# EAGLE design as3320-BandPass-Dev2 (EAGLE 9.6.2)

## Sheet 1 of 5: CEM
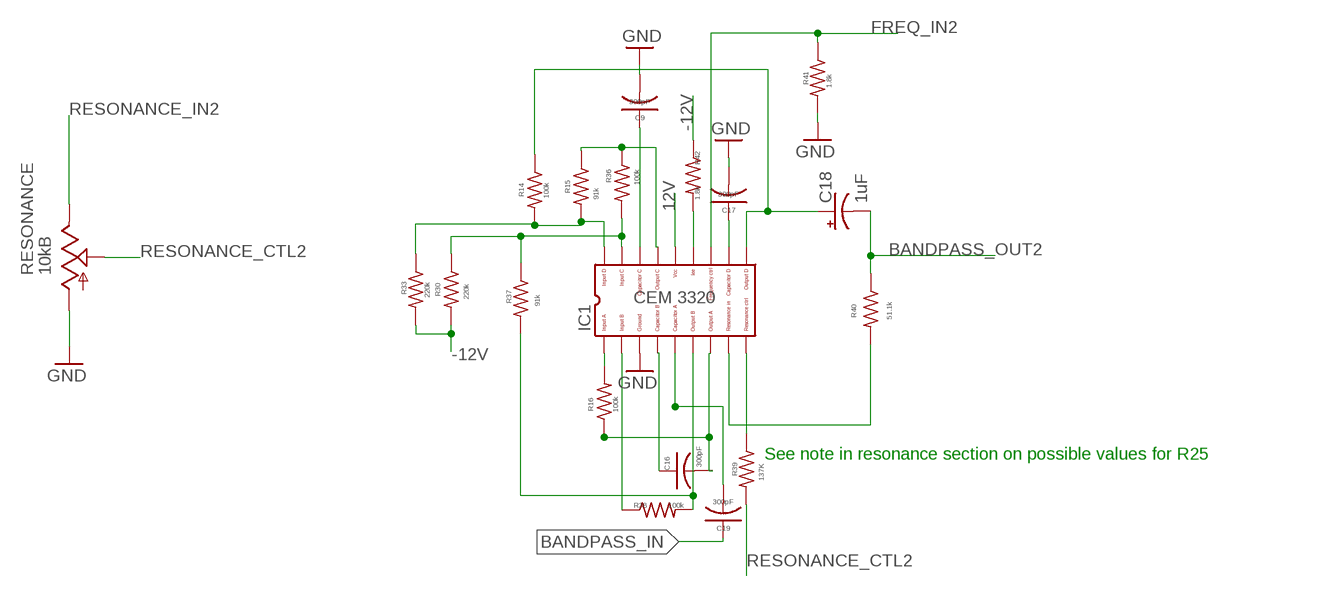
[diagram p0: schematic, sheet 1]

### Parts
C9  300pF  C-USC0805K  [C0805K]
C16  300pF  C-USC0805K  [C0805K]
C17  300pF  C-USC0805K  [C0805K]
C18  1uF  CPOL-USB  [PANASONIC_B]
C19  300pF  C-USC0805K  [C0805K]
IC1  CEM3320  [DIL18]
R14  100k  GMSN_R-US_M0805  [GMSN_M0805]
R15  91k  GMSN_R-US_M0805  [GMSN_M0805]
R16  100k  GMSN_R-US_M0805  [GMSN_M0805]
R30  220k  GMSN_R-US_M0805  [GMSN_M0805]
R33  220k  GMSN_R-US_M0805  [GMSN_M0805]
R36  100k  GMSN_R-US_M0805  [GMSN_M0805]
R37  91k  GMSN_R-US_M0805  [GMSN_M0805]
R38  100k  GMSN_R-US_M0805  [GMSN_M0805]
R39  137K  GMSN_R-US_M0805  [GMSN_M0805]
R40  51.1k  GMSN_R-US_M0805  [GMSN_M0805]
R41  1.8k  GMSN_R-US_M0805  [GMSN_M0805]
R42  1.8k  GMSN_R-US_M0805  [GMSN_M0805]
RESONANCE  10kB  POT_USVERTICAL  [ALPS_POT_VERTICAL]

### Nets
12V [power]: IC1.14 ; also sheet 2,3
-12V [power]: R30.2 R33.2 R42.1 ; also sheet 2,3
BANDPASS_IN: C19.1 ; also sheet 3
BANDPASS_OUT2: C18.- R40.1 ; also sheet 5
FREQ_IN2: IC1.12 R41.1 ; also sheet 3
GND [power]: C9.2 C17.2 IC1.3 R41.2 RESONANCE.P$3(A) ; also sheet 2,3,4,5
N$18 [nearfilter]: C17.1 IC1.11
N$21: IC1.9 R39.1
N$28 [nearfilter]: IC1.8 R40.2
N$29 [nearfilter]: IC1.13 R42.2
N$30: C9.1 IC1.16
N$31 [nearfilter]: C18.+ IC1.10 R14.1
N$32: C19.2 IC1.5
N$33: C16.2 IC1.7 R16.1
N$34: C16.1 IC1.4
N$35: IC1.2 R38.1
N$36: IC1.6 R37.2 R38.2
N$37: IC1.1 R16.2
N$38: IC1.17 R30.1 R36.2 R37.1
N$41: IC1.15 R15.1 R36.1
N$42: IC1.18 R14.2 R15.2 R33.1
RESONANCE_CTL2: R39.2 RESONANCE.P$2(S)
RESONANCE_IN2: RESONANCE.P$1(E) ; also sheet 3

### Notes on the sheet
- See note in resonance section on possible values for R25

## Sheet 2 of 5: Power
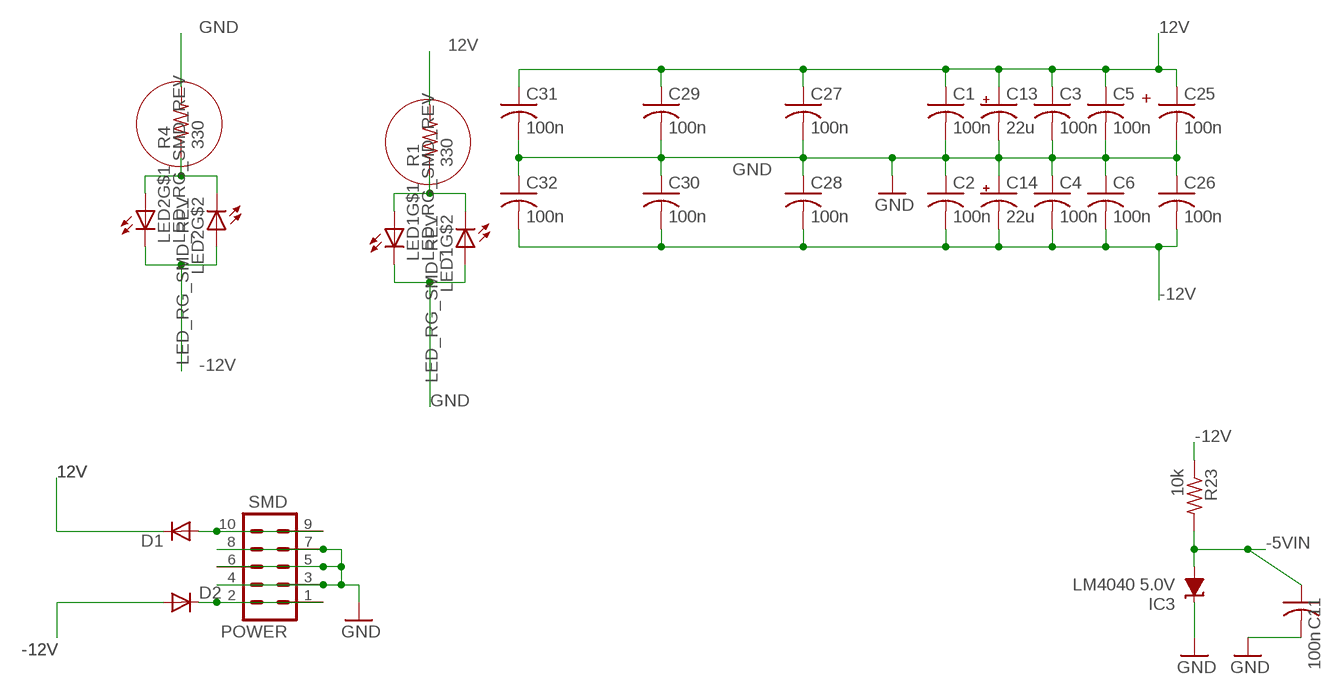
[diagram p1: schematic, sheet 2]

### Parts
C1  100n  C-USC0805K  [C0805K]
C2  100n  C-USC0805K  [C0805K]
C3  100n  C-USC0805K  [C0805K]
C4  100n  C-USC0805K  [C0805K]
C5  100n  C-USC0805K  [C0805K]
C6  100n  C-USC0805K  [C0805K]
C11  100n  GMSN_C-USC0805K  [GMSN_C0805K]
C13  22u  CPOL-USB  [PANASONIC_B]
C14  22u  CPOL-USB  [PANASONIC_B]
C25  100n  C-USC0805K  [C0805K]
C26  100n  C-USC0805K  [C0805K]
C27  100n  C-USC0805K  [C0805K]
C28  100n  C-USC0805K  [C0805K]
C29  100n  C-USC0805K  [C0805K]
C30  100n  C-USC0805K  [C0805K]
C31  100n  C-USC0805K  [C0805K]
C32  100n  C-USC0805K  [C0805K]
D1  1N5819HW  DIODE-SOD123  [SOD123]
D2  1N5819HW  DIODE-SOD123  [SOD123]
IC3  LM4040 5.0V  LM4041C12DBZ  [DBZ_R-PDSO-G3]
LED1  LED_RG_SMD_REV  [LSG_T77K]
LED2  LED_RG_SMD_REV  [LSG_T77K]
POWER  SMD  CONN_05X2SHD_SMD  [2X5-SHROUDED_SMD]
R1  330  GMSN_R-US_M0805  [GMSN_M0805]
R4  330  GMSN_R-US_M0805  [GMSN_M0805]
R23  10k  GMSN_R-US_M0805  [GMSN_M0805]

### Nets
12V [power]: C1.1 C3.1 C5.1 C13.+ C25.1 C27.1 C29.1 C31.1 D1.C R1.2 ; also sheet 1,3
-5VIN [power]: C11.1 IC3.2(A) R23.2 ; also sheet 4
-12V [power]: C2.2 C4.2 C6.2 C14.- C26.2 C28.2 C30.2 C32.2 D2.A LED2.1(C) LED2.4(A) R23.1 ; also sheet 1,3
-12V-P: D2.C POWER.1 POWER.2
GND [power]: C1.2 C2.1 C3.2 C4.1 C5.2 C6.1 C11.2 C13.- C14.+ C25.2 C26.1 C27.2 C28.1 C29.2 C30.1 C31.2 C32.1 IC3.1(C) LED1.1(C) LED1.4(A) POWER.3 POWER.4 POWER.5 POWER.6 POWER.7 POWER.8 R4.2 ; also sheet 1,3,4,5
N$6: D1.A POWER.9 POWER.10
N$74: LED2.2(A) LED2.3(C) R4.1
N$75: LED1.2(A) LED1.3(C) R1.1

### Notes on the sheet
- +

## Sheet 3 of 5: Input
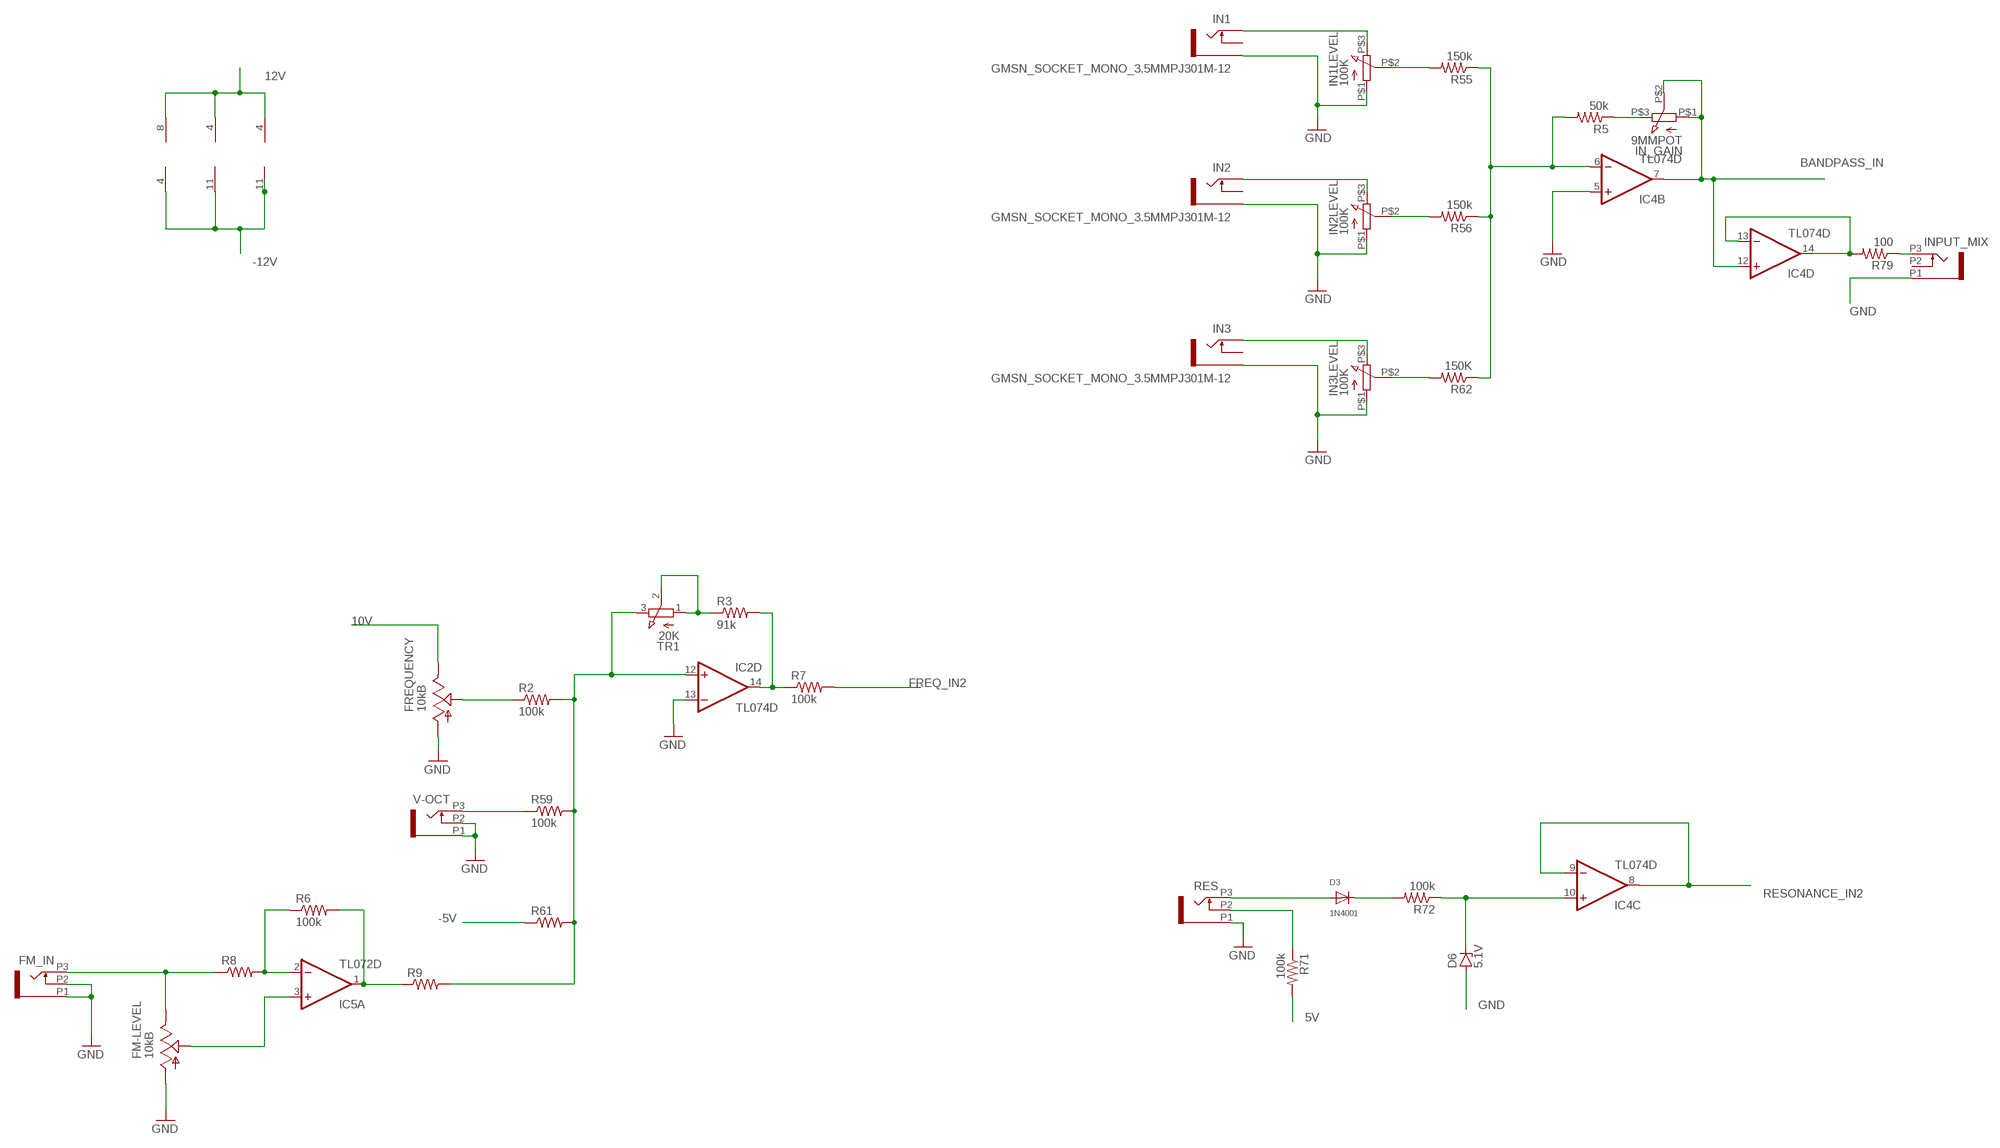
[diagram p2: schematic, sheet 3]

### Parts
D3  1N4001  DIODESMA  [SMADIODE]
D6  5.1V  ZENER-DIODESOT23  [SOT23]
FM-LEVEL  10kB  POT_USVERTICAL  [ALPS_POT_VERTICAL]
FM_IN  PJ301_THONKICONN6  [WQP_PJ_301M6]
FREQUENCY  10kB  POT_USVERTICAL  [ALPS_POT_VERTICAL]
IC2  TL074D  [SO14]
IC4  TL074D  [SO14]
IC5  TL072D  [SO08]
IN1  GMSN_SOCKET_MONO_3.5MMPJ301M-12  [GMSN_PJ301M-12]
IN1LEVEL  100K  9MMPOT  [POT]
IN2  GMSN_SOCKET_MONO_3.5MMPJ301M-12  [GMSN_PJ301M-12]
IN2LEVEL  100K  9MMPOT  [POT]
IN3  GMSN_SOCKET_MONO_3.5MMPJ301M-12  [GMSN_PJ301M-12]
IN3LEVEL  100K  9MMPOT  [POT]
IN_GAIN  9MMPOT  [POT]
INPUT_MIX  PJ301_THONKICONN6  [WQP_PJ_301M6]
R2  100k  GMSN_R-US_M0805  [GMSN_M0805]
R3  91k  GMSN_R-US_M0805  [GMSN_M0805]
R5  50k  GMSN_R-US_M0805  [GMSN_M0805]
R6  100k  GMSN_R-US_M0805  [GMSN_M0805]
R7  100k  GMSN_R-US_M0805  [GMSN_M0805]
R8  62k  GMSN_R-US_M0805  [GMSN_M0805]
R9  62k  GMSN_R-US_M0805  [GMSN_M0805]
R55  150k  R-US_R0805  [R0805]
R56  150k  R-US_R0805  [R0805]
R59  100k  GMSN_R-US_M0805  [GMSN_M0805]
R61  62k  GMSN_R-US_M0805  [GMSN_M0805]
R62  150K  R-US_R0805  [R0805]
R71  100k  R-US_R0805  [R0805]
R72  100k  GMSN_R-US_M0805  [GMSN_M0805]
R79  100  GMSN_R-US_M0805  [GMSN_M0805]
RES  PJ301_THONKICONN6  [WQP_PJ_301M6]
TR1  20K  TRIMMER_TH3  [TRIMMER_TH3]
V-OCT  PJ301_THONKICONN6  [WQP_PJ_301M6]

### Nets
5V [power]: R71.2 ; also sheet 4
10V [power]: FREQUENCY.P$1(E) ; also sheet 4
12V [power]: IC2.4(P:V+) IC4.4(P:V+) IC5.8(P:V+) ; also sheet 1,2
-5V [power]: R61.1 ; also sheet 4
-12V [power]: IC2.11(P:V-) IC4.11(P:V-) IC5.4(P:V-) ; also sheet 1,2
BANDPASS_IN: IC4.7(B:OUT) IC4.12(D:+IN) IN_GAIN.P$1 IN_GAIN.P$2 ; also sheet 1
FREQ_IN2: R7.2 ; also sheet 1
GND [power]: D6.1(A) FM-LEVEL.P$3(A) FM_IN.P1 FM_IN.P2 FREQUENCY.P$3(A) IC2.13(D:-IN) IC4.5(B:+IN) IN1.GND(SLEEVE) IN1LEVEL.P$1 IN2.GND(SLEEVE) IN2LEVEL.P$1 IN3.GND(SLEEVE) IN3LEVEL.P$1 INPUT_MIX.P1 RES.P1 V-OCT.P1 V-OCT.P2 ; also sheet 1,2,4,5
N$2: IC5.2(A:-IN) R6.1 R8.2
N$3: IC2.14(D:OUT) R3.2 R7.1
N$4: IC5.1(A:OUT) R6.2 R9.1
N$5: FREQUENCY.P$2(S) R2.1
N$7: FM-LEVEL.P$2(S) IC5.3(A:+IN)
N$8: FM-LEVEL.P$1(E) FM_IN.P3 R8.1
N$9: R71.1 RES.P2
N$12: IC2.12(D:+IN) R2.2 R9.2 R59.2 R61.2 TR1.3
N$20: IN_GAIN.P$3 R5.1
N$67: R59.1 V-OCT.P3
N$68: R3.1 TR1.1 TR1.2
N$76: IN1.TIP IN1LEVEL.P$3
N$77: IN2.TIP IN2LEVEL.P$3
N$78: D3.A RES.P3
N$79: IN1LEVEL.P$2 R55.2
N$80: IN2LEVEL.P$2 R56.2
N$82: IN3.TIP IN3LEVEL.P$3
N$83: IN3LEVEL.P$2 R62.2
N$84: IC4.6(B:-IN) R5.2 R55.1 R56.1 R62.1
N$85: D3.C R72.2
N$89: D6.3(C) IC4.10(C:+IN) R72.1
N$102: IC4.13(D:-IN) IC4.14(D:OUT) R79.2
N$103: INPUT_MIX.P3 R79.1
RESONANCE_IN2: IC4.8(C:OUT) IC4.9(C:-IN) ; also sheet 1
Unconnected: IN1.NORM(SWITCH) IN2.NORM(SWITCH) IN3.NORM(SWITCH) INPUT_MIX.P2

## Sheet 4 of 5: Ref
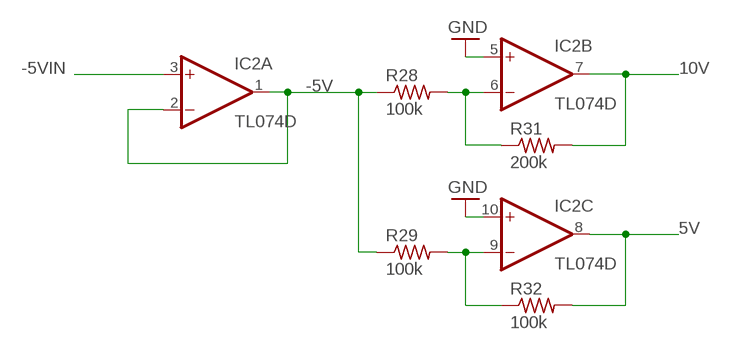
[diagram p3: schematic, sheet 4]

### Parts
R28  100k  GMSN_R-US_M0805  [GMSN_M0805]
R29  100k  GMSN_R-US_M0805  [GMSN_M0805]
R31  200k  GMSN_R-US_M0805  [GMSN_M0805]
R32  100k  GMSN_R-US_M0805  [GMSN_M0805]

### Nets
5V [power]: IC2.8(C:OUT) R32.2 ; also sheet 3
10V [power]: IC2.7(B:OUT) R31.2 ; also sheet 3
-5V [power]: IC2.1(A:OUT) IC2.2(A:-IN) R28.1 R29.1 ; also sheet 3
-5VIN [power]: IC2.3(A:+IN) ; also sheet 2
GND [power]: IC2.5(B:+IN) IC2.10(C:+IN) ; also sheet 1,2,3,5
N$13: IC2.9(C:-IN) R29.2 R32.1
N$15: IC2.6(B:-IN) R28.2 R31.1

## Sheet 5 of 5: Output
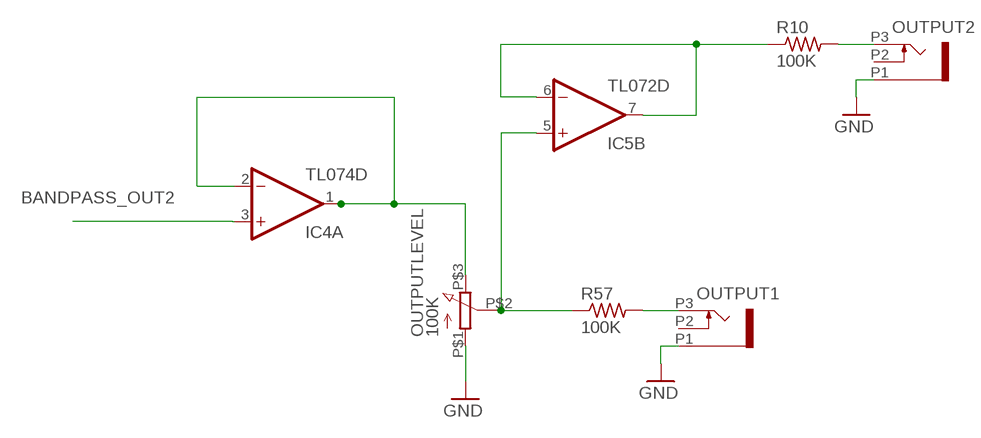
[diagram p4: schematic, sheet 5]

### Parts
OUTPUT1  PJ301_THONKICONN6  [WQP_PJ_301M6]
OUTPUT2  PJ301_THONKICONN6  [WQP_PJ_301M6]
OUTPUTLEVEL  100K  9MMPOT  [POT]
R10  100K  GMSN_R-US_M0805  [GMSN_M0805]
R57  100K  GMSN_R-US_M0805  [GMSN_M0805]

### Nets
BANDPASS_OUT2: IC4.3(A:+IN) ; also sheet 1
GND [power]: OUTPUT1.P1 OUTPUT2.P1 OUTPUTLEVEL.P$1 ; also sheet 1,2,3,4
N$11: IC5.5(B:+IN) OUTPUTLEVEL.P$2 R57.1
N$14: IC5.6(B:-IN) IC5.7(B:OUT) R10.1
N$63: IC4.1(A:OUT) IC4.2(A:-IN) OUTPUTLEVEL.P$3
O1: OUTPUT2.P3 R10.2
O2: OUTPUT1.P3 R57.2
Unconnected: OUTPUT1.P2 OUTPUT2.P2

## Library data of the parts
C1-C6 C9 C16 C17 C19 C25-C32 = rcl:C-US: CAPACITOR, American symbol; SPICEPREFIX: C
C11 = Pure VCF:GMSN_C-US: CAPACITOR, American symbol
C13 C14 = rcl:CPOL-US: POLARIZED CAPACITOR, American symbol
C18 = rcl:CPOL-US: POLARIZED CAPACITOR, American symbol; SPICEPREFIX: C
D1 D2 = diode:DIODE-: DIODE
D3 = GMSN:DIODE: Diode SMADIODE - SMA Surface Mount Package 20V 1A Schottky Diode Digikey: 641-1014-6-ND DO-1N4148 - Through Hole Small Current Diode SOD-123 20V 1 A (.5mV Vf) Schottky Diode - Digikey: MBRX120TPMSCT-ND SOD-323 10V 570mA (.38mV Vf, 3ns) Schottky Diode - Digikey: ZLLS410CT-ND SOD-523 30V 30mA Schottky Diode (RB751S-40TE61) - Digikey: RB751S-40TE61CT-ND SOT23-R/W - SOT23 Package (R = Solder Paste/Reflow Ovens, W = Hand-Soldering) BAT54Film 40V 300mA - Digikey: 497-7162-1-ND
D6 = diode:ZENER-DIODE: Z-Diode; RS-PART: 816-7962
FM-LEVEL FREQUENCY RESONANCE = og-pots:POT_US
FM_IN INPUT_MIX OUTPUT1 OUTPUT2 RES V-OCT = og-pj301_variations:PJ301_THONKICONN
IC1 = CEM:CEM3320: CEM 3330 VCF
IC2 = linear:TL074: OP AMP
IC3 = texas:LM4041: PRECISION MICROPOWER SHUNT VOLTAGE REFERENCE Source: http://focus.ti.com/lit/ds/slcs146e/slcs146e.pdf
IC4 = GMSN:TL074: OP AMP
IC5 = GMSN-R2Project:TL072: OP AMP
IN1-IN3 = Pure VCO:GMSN_SOCKET_MONO_3.5MM: 3.5 mm Jack Socket; SORT: 8
IN1LEVEL IN2LEVEL IN3LEVEL IN_GAIN OUTPUTLEVEL = GMSN:9MMPOT
LED1 = INSTRUO:LED_RG_SMD_REV: http://uk.rs-online.com/web/p/visible-leds/7193196/; RS-PART: 915-4828
LED2 = INSTRUO:LED_RG_SMD_REV: http://uk.rs-online.com/web/p/visible-leds/7193196/
POWER = SparkFun-Connectors:CONN_05X2: Multi connection point. Often used as Generic Header-pin footprint for 0.1 inch spaced/style header connections For AVR SPI programming port, see special device with nice symbol: "AVR_SPI_PROG_5x2.dev" You can populate with any combo of single row headers, but if you'd like an exact match, check these: 2x5 AVR ICSP Male Header <https://www.sparkfun.com/products/778> (PRT-00778) 2x5 Pin Shrouded Header <https://www.sparkfun.com/products/8506> (PRT-08506) On any of the 0.1 inch spaced packages, you can populate with these: Break Away Headers - Straight <https://www.sparkfun.com/products/116> (PRT-00116) Break Away Male Headers - Right Angle <https://www.sparkfun.com/products/553> (PRT-00553) Female Headers <https://www.sparkfun.com/products/115> (PRT-00115) Break Away Headers - Machine Pin <https://www.sparkfun.com/products/117> (PRT-00117) Break Away Female Headers - Swiss Machine Pin <https://www.sparkfun.com/products/743> (PRT-00743) Special note: the shrouded connector mates well with our 5x2 ribbon cables: 2x5 Pin IDC Ribbon Cable <https://www.sparkfun.com/products/8535> (PRT-08535); PROD_ID: CONN-09508; RS-PART: 828-1783
R1-R3 R5-R10 R14-R16 R23 R28-R33 R36-R42 R57 R59 R61 R72 R79 = Pure VCF:GMSN_R-US_: RESISTOR, American symbol
R4 = Pure VCF:GMSN_R-US_: RESISTOR, American symbol; RS-PART: 915-4828
R55 R56 R62 R71 = GMSN:R-US_: RESISTOR, American symbol
TR1 = GMSN:TRIMMER_TH3

## Net classes
0 default: width 0.152 mm
1 power: width 0.406 mm
2 nearfilter: width 0.152 mm

## Board
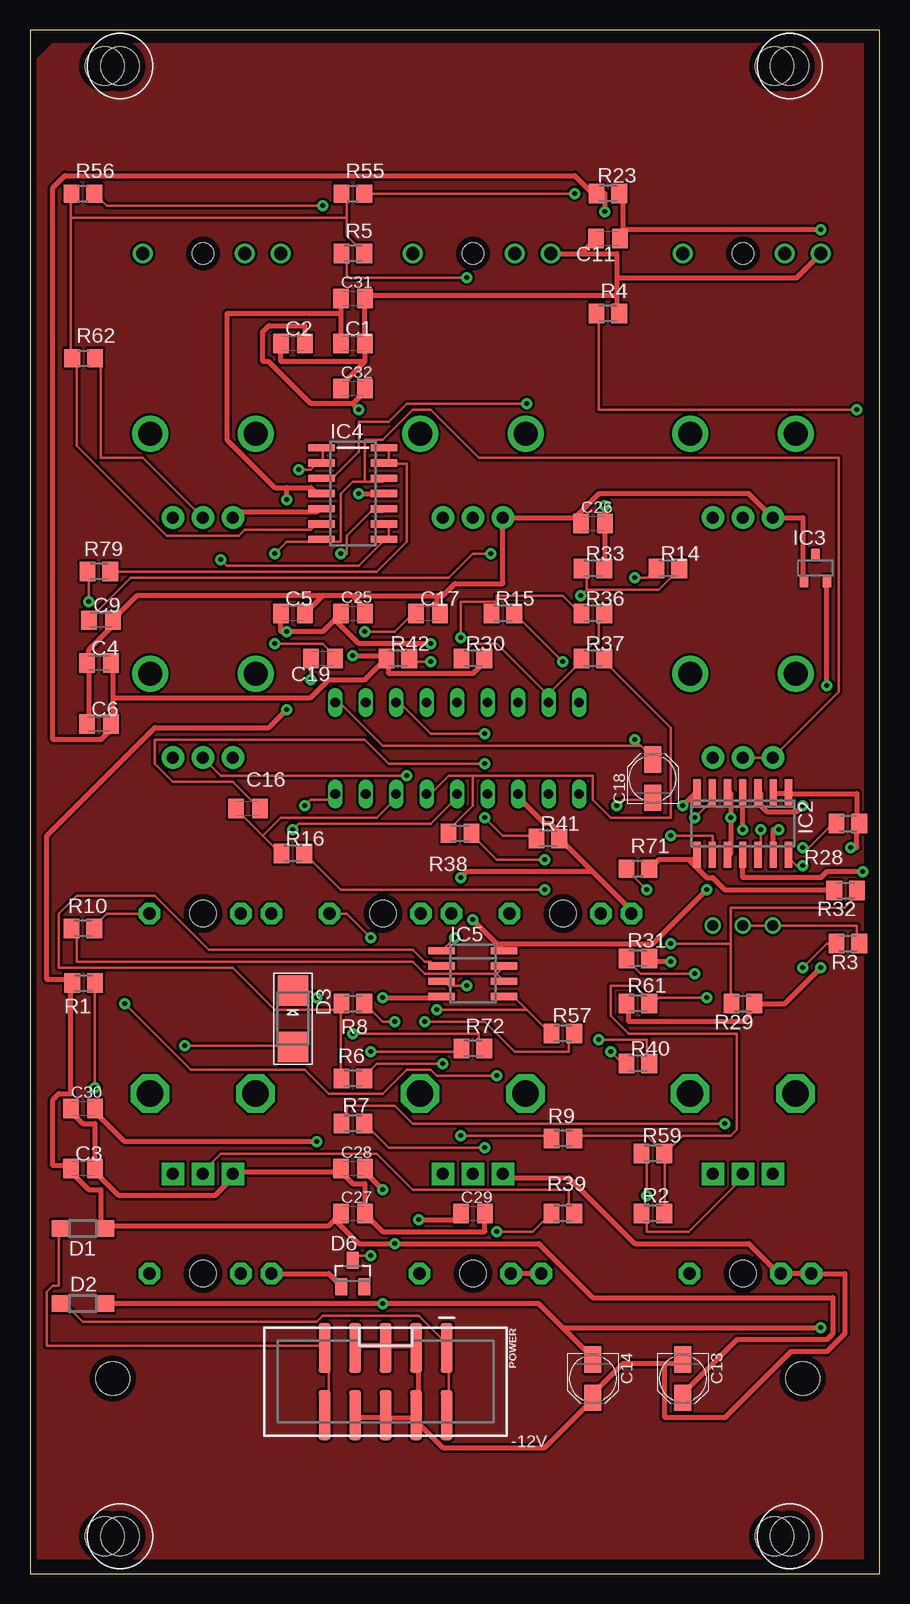
[diagram p5: board, top side]
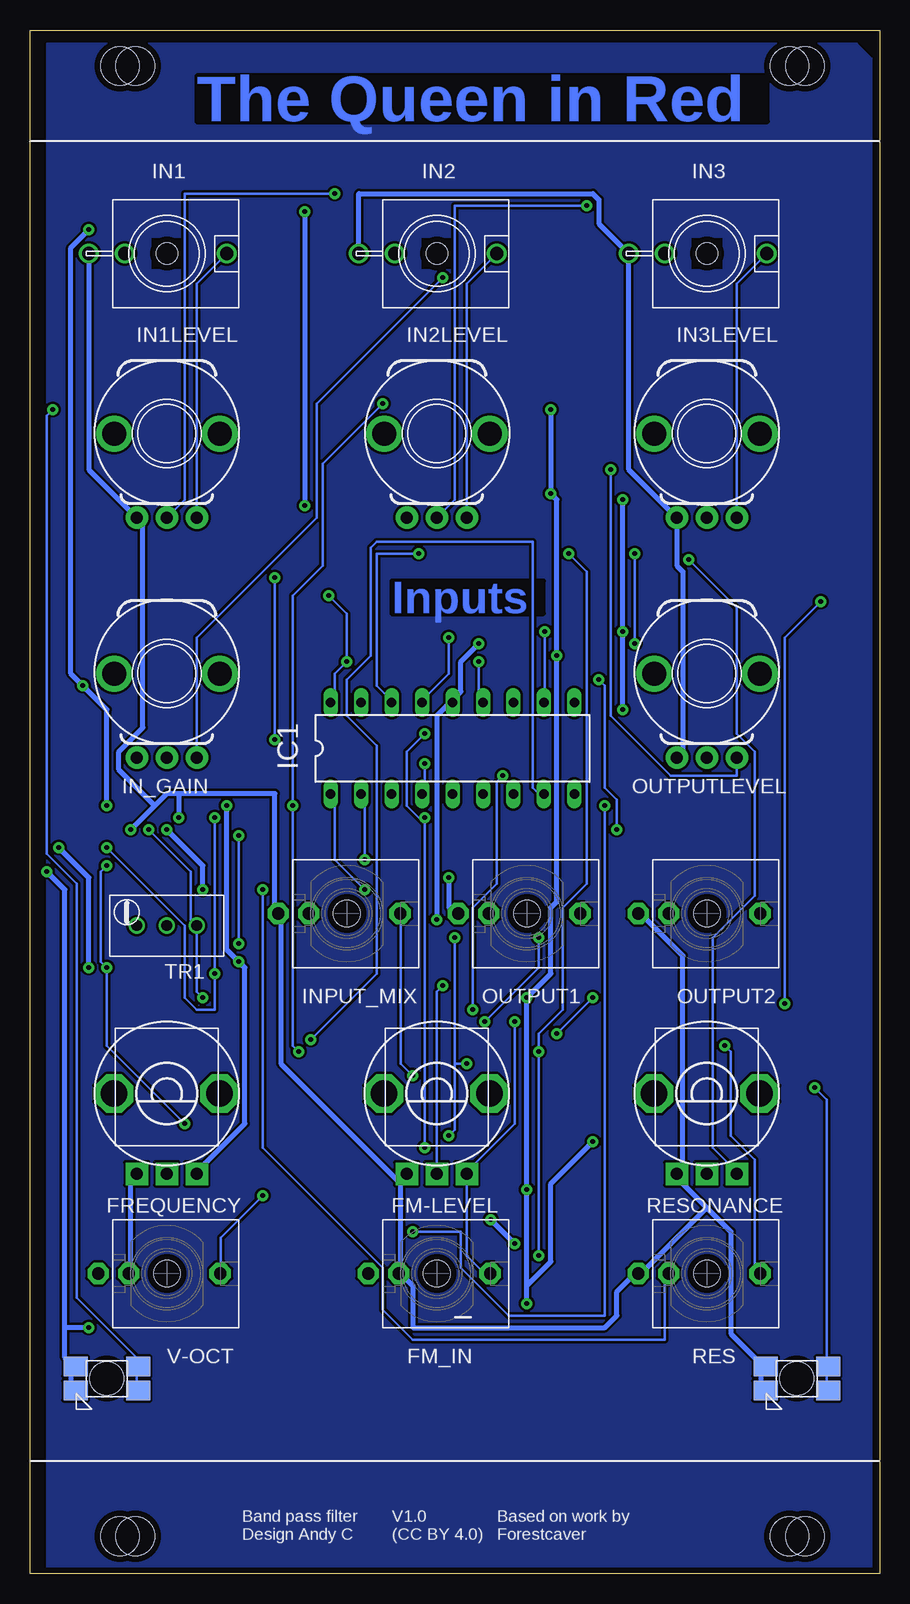
[diagram p6: board, bottom side, seen from below]

Size 70.8 x 128.63 mm. Coordinates in mm from the lower left corner, seen from the top.
Outline: 70.8,0 70.8,128.63 0,128.63 0,0 70.8,0
Copper layers (1*16): Top 0.035mm / dielectric 1.5mm / Bottom 0.035mm
Design rules "Mutable_PCBCart-Standard *": minimum track width 8mil, minimum drill 0.4mm, track to track 8mil, track to pad 8mil, pad to pad 8mil, via to via 8mil, smd to smd 8mil, copper to edge 20mil, drill to drill 8mil, minimum pad ring 8mil, minimum via ring 10mil, stop-mask expansion 3mil, vias tented up to drill 25mil, thermal gap 8mil

### Footprints (pad centres in the part's own frame; a part is rotated, then mirrored left to right if it is on the bottom)
C0805K = smd 1.3 x 1.6: 1 -1,0; 2 1,0
GMSN_C0805K = smd 1.3 x 1.6: 1 -1,0; 2 1,0
PANASONIC_B = smd 2.2 x 1.4: + 1.6,0; - -1.6,0
SOD123 = smd 1.4 x 1.4: A 1.9,0; C -1.9,0
SMADIODE = smd 2.54 x 2.54: A 2.349,0; C -2.349,0
SOT23 = smd 1 x 1.4: 1 -0.95,-1.1; 2 0.95,-1.1; 3 0,1.1
ALPS_POT_VERTICAL = drill 1 pad 1.88 square: P$1 -2.5,6.7; P$2 0,6.7; P$3 2.5,6.7 | drill 2.2 pad 3.175 octagon: P$4 -4.4,0; P$5 4.4,0
WQP_PJ_301M6 = drill 1.016 pad 1.778 octagon: P1 0,-5.715; P2 0,-3.175; P3 0,4.445 | hole 2.2: 0,0
DIL18 = drill 0.813 long: 1 -10.16,-3.81; 2 -7.62,-3.81; 3 -5.08,-3.81; 4 -2.54,-3.81; 5 0,-3.81; 6 2.54,-3.81; 7 5.08,-3.81; 8 7.62,-3.81; 9 10.16,-3.81; 10 10.16,3.81; 11 7.62,3.81; 12 5.08,3.81; 13 2.54,3.81; 14 0,3.81; 15 -2.54,3.81; 16 -5.08,3.81; 17 -7.62,3.81; 18 -10.16,3.81
SO14 = smd 0.6 x 2.2: 1 -3.81,-2.6; 2 -2.54,-2.6; 3 -1.27,-2.6; 4 0,-2.6; 5 1.27,-2.6; 6 2.54,-2.6; 7 3.81,-2.6; 8 3.81,2.6; 9 2.54,2.6; 10 1.27,2.6; 11 0,2.6; 12 -1.27,2.6; 13 -2.54,2.6; 14 -3.81,2.6
DBZ_R-PDSO-G3 = smd 0.7 x 1: 1 -0.95,-1.1; 2 0.95,-1.1; 3 0,1.1
SO08 = smd 0.6 x 2.2: 1 -1.905,-2.6; 2 -0.635,-2.6; 3 0.635,-2.6; 4 1.905,-2.6; 5 1.905,2.6; 6 0.635,2.6; 7 -0.635,2.6; 8 -1.905,2.6
GMSN_PJ301M-12 = drill 1.1: GND 0,-6.5; NORM 0,-3.5; TIP 0,5 | hole 1.778: 0,0
POT = drill 1 pad 1.88: P$1 -2.5,-7; P$2 0,-7; P$3 2.5,-7 | drill 2 pad 2.68: P$4 -4.4,0; P$5 4.4,0
LSG_T77K = smd 2 x 1.6: 1 -2.6,-1; 2 2.6,-1; 3 2.6,1; 4 -2.6,1 | hole 2.8: 0,0
2X5-SHROUDED_SMD = smd 4.15 x 1: 1 -2.794,5.08; 2 2.794,5.08; 3 -2.794,2.54; 4 2.794,2.54; 5 -2.794,0; 6 2.794,0; 7 -2.794,-2.54; 8 2.794,-2.54; 9 -2.794,-5.08; 10 2.794,-5.08
GMSN_M0805 = smd 1.3 x 1.6: 1 -0.95,0; 2 0.95,0
R0805 = smd 1.3 x 1.5: 1 -0.95,0; 2 0.95,0
TRIMMER_TH3 = drill 0.9: 1 2.5,0; 2 0,0; 3 -2.5,0
MOUNTING_HOLE = hole 3.2: 0,0; 0,1.27

### Placement (x,y rotation side)
C1  26.9,102.5 0 top
C2  21.9,102.5 0 top
C3  4.4,33.75 0 top
C4  5.74,75.88 0 top
C5  21.9,80 0 top
C6  5.74,70.8 0 top
C9  5.9,79.45 0 top
C11  48.15,111.25 180 top
C13  54.4,16.25 270 top
C14  46.9,16.25 270 top
C16  18.15,63.75 180 top
C17  33.15,80 0 top
C18  51.9,66.25 90 top
C19  24.4,76.25 180 top
C25  26.9,80 0 top
C26  46.9,87.5 0 top
C27  26.9,30 0 top
C28  26.9,33.75 0 top
C29  36.9,30 0 top
C30  4.4,38.75 0 top
C31  26.9,106.25 0 top
C32  26.9,98.75 0 top
D1  4.4,28.75 180 top
D2  4.4,22.5 0 top
D3  21.9,46.25 270 top
D6  26.9,25 0 top
FM-LEVEL  36.9,40 180 bottom
FM_IN  36.9,25 270 bottom
FREQUENCY  59.4,40 180 bottom
IC1  35.59,68.77 0 bottom
IC2  59.4,62.5 180 top
IC3  65.45,83.8 0 top
IC4  26.9,90 270 top
IC5  36.9,50 270 top
IN1  59.4,110 270 bottom
IN1LEVEL  59.4,95 0 bottom
IN2  36.9,110 270 bottom
IN2LEVEL  36.9,95 0 bottom
IN3  14.4,110 270 bottom
IN3LEVEL  14.4,95 0 bottom
IN_GAIN  59.4,75 0 bottom
INPUT_MIX  44.4,55 270 bottom
LED1  6.9,16.25 0 bottom
LED2  64.4,16.25 0 bottom
OUTPUT1  29.4,55 270 bottom
OUTPUT2  14.4,55 270 bottom
OUTPUTLEVEL  14.4,75 0 bottom
POWER  29.64,16 270 top
R1  4.47,49.21 180 top
R2  51.9,30 0 top
R3  68.15,52.5 180 top
R4  48.15,105 0 top
R5  26.9,110 0 top
R6  26.9,41.25 0 top
R7  26.9,37.5 0 top
R8  26.9,47.5 180 top
R9  44.4,36.25 0 top
R10  4.4,53.75 0 top
R14  53.15,83.75 0 top
R15  39.4,80 0 top
R16  21.9,60 0 top
R23  48.15,115 0 top
R28  68.15,62.5 180 top
R29  59.4,47.5 180 top
R30  36.9,76.25 0 top
R31  50.65,51.25 0 top
R32  67.97,56.93 180 top
R33  46.9,83.75 0 top
R36  46.9,80 0 top
R37  46.9,76.25 0 top
R38  35.84,61.69 180 top
R39  44.4,30 0 top
R40  50.65,42.5 0 top
R41  43.15,61.25 0 top
R42  30.65,76.25 0 top
R55  26.9,115 0 top
R56  4.4,115 0 top
R57  44.4,45 0 top
R59  51.9,35 0 top
R61  50.65,47.5 0 top
R62  4.47,101.28 0 top
R71  50.65,58.75 0 top
R72  36.9,43.75 0 top
R79  5.74,83.5 0 top
RES  14.4,25 270 bottom
RESONANCE  14.4,40 180 bottom
TR1  59.4,54 180 bottom
U$2  [MOUNTING_HOLE]  7.5,3.11 90 top
U$3  [MOUNTING_HOLE]  63.3,3.11 90 top
U$4  [MOUNTING_HOLE]  63.3,125.63 90 top
U$5  [MOUNTING_HOLE]  7.5,125.63 90 top
V-OCT  59.4,25 270 bottom

### Tracks (layer width: path | path; a pad name or v marks a point on that pad's centre or on a via)
5V
  Top 0.406: 54.9,59.5 55.4,59.5 IC2.8 | 54.9,59.5 52.4,59.5 51.9,59 R71.2 | 54.9,59.5 56.4,58 56.9,58 57.9,57 66.9,57 R32.2
10V  (via drill 0.4)
  Top 0.406: v53.4,51 51.9,51 R31.2 | v54.4,64 55.4,65 IC2.7
  Bottom 0.406: FREQUENCY.P$1 56.9,33.5 52.9,37.5 52.9,50.5 v53.4,51 54.4,52 v54.4,64
12V  (via drill 0.4)
  Top 0.406: C31.1 25.9,105 | 25.9,105 C1.1 | 21.4,90.5 20.4,90.5 16.4,94.5 16.4,105 25.9,105 | 21.4,90.5 23.4,90.5 23.9,90 IC4.4 | C5.1 20.9,78.5 v21.4,78.5 24.4,78.5 25.4,79.5 | v36.9,54.5 38.9,52.5 | 38.9,52.5 39.4,52 IC5.8 | v59.4,62 IC2.4 | v56.4,57 51.9,52.5 38.9,52.5 | 25.4,79.5 27.4,77.5 v33.4,77.5 | 25.4,79.5 C25.1 | v21.4,89.5 21.4,90.5 | 25.4,29.5 24.9,29 6.4,29 D1.C 5.9,29 5.9,32 4.9,32 3.4,33.5 C3.1 3.4,34 1.9,34 1.9,39.5 2.4,40 3.4,40 3.4,49 R1.2 3.4,49.5 1.4,49.5 1.4,61.5 10.4,70.5 19.9,70.5 v21.4,72 | C29.1 35.4,29.5 v32.4,29.5 | 25.4,29.5 27.4,27.5 v30.4,27.5 42.4,27.5 46.9,23 66.9,23 66.9,20 66.4,19.5 58.9,19.5 54.4,15 C13.+ | 25.4,29.5 C27.1
  Bottom 0.406: v36.9,54.5 36.9,71.5 35.9,72.5 IC1.14 35.4,73 34.9,73.5 34.9,76 v33.4,77.5 | v59.4,62 56.4,59 v56.4,57 | v21.4,89.5 v21.4,78.5 v21.4,72 | v30.4,27.5 v32.4,29.5
-5V  (via drill 0.4)
  Top 0.406: 68.9,62.5 68.9,65 63.4,65 | 63.4,65 61.9,65 IC2.2 | 63.4,65 IC2.1 | R61.1 49.9,47.5 49.9,46 59.4,46 59.9,46.5 59.9,47.5 R29.1 62.9,47.5 v65.9,50.5 | 68.9,62.5 68.9,60.5 v68.4,60.5 | 68.9,62.5 R28.1
  Bottom 0.406: v68.4,60.5 65.9,58 v65.9,50.5
-5VIN  (via drill 0.4)
  Top 0.406: 49.4,112 49.4,115 R23.2 | 49.4,112 49.4,111.5 C11.1 49.4,112 | v66.4,74 IC3.2 | v64.4,64 63.9,63.5 61.4,63.5 60.9,64 60.9,65 IC2.3 | v65.9,112 49.4,112
  Bottom 0.406: v64.4,64 64.4,72 v66.4,74 67.4,75 67.4,110.5 v65.9,112
-12V  (via drill 0.4)
  Top 0.406: R42.1 29.9,76 29.9,75 36.9,75 37.9,76 R30.2 | R33.2 47.9,84 C26.2 v47.9,89 | 6.9,73 6.9,75.5 C4.2 | 6.9,73 6.9,71 C6.2 6.9,70.5 5.9,69.5 1.9,69.5 1.9,115.5 2.9,116.5 45.4,116.5 46.9,115 R23.1 47.9,115 v47.9,113.5 | 6.9,73 23.4,73 24.9,74.5 27.9,74.5 29.4,76 R42.1 | IC2.11 59.4,58 65.9,58 66.4,58.5 v69.4,58.5 | C2.2 22.9,104 19.9,104 19.4,103.5 19.4,101 19.9,101 23.4,97.5 26.9,97.5 | 26.9,97.5 27.9,98.5 C32.2 | v27.4,90 IC4.11 | 26.9,97.5 v27.4,97 | D2.A v29.4,22.5 42.4,22.5 44.4,20.5 | 44.4,20.5 46.9,18 C14.- | v29.4,32 27.9,33.5 C28.2 | v23.9,36 7.9,36 5.4,38.5 C30.2 | v29.4,48 33.9,48 IC5.4 | 44.4,20.5 v65.9,20.5 | v26.9,76.5 29.4,76.5 R42.1
  Bottom 0.406: v47.9,113.5 v47.9,89 | LED2.1 67.4,15.5 67.4,17 LED2.4 67.4,17.5 67.9,18 67.9,20.5 | v69.4,58.5 67.9,57 67.9,20.5 | v27.4,97 v27.4,90 26.9,89.5 v26.9,76.5 26.9,56 27.4,55.5 27.4,50 v29.4,48 v29.4,32 29.4,24 | v29.4,22.5 29.4,24 | v23.9,36 27.4,32.5 27.4,26 29.4,24 | v65.9,20.5 67.9,20.5
-12V-P
  Top 0.203: D2.C 2.9,22.5 4.4,21 23.9,21 24.4,21.5 32.4,21.5 34.9,19 POWER.1 34.9,18.5 34.9,13.5 POWER.2
BANDPASS_IN  (via drill 0.4)
  Top 0.203: IN_GAIN.P$2 IN_GAIN.P$1 67.4,73.5 67.4,93 37.4,93 33.4,97 31.9,97 29.4,94.5 27.9,94.5 27.9,91 | v20.4,77.5 24.4,77.5 25.4,76.5 C19.1 | v20.4,85 21.4,86 23.9,86 IC4.7 24.4,86 25.9,86 25.9,90 26.9,91 27.9,91 | 27.9,91 29.4,91 IC4.12
  Bottom 0.203: v20.4,85 v20.4,77.5
BANDPASS_OUT2  (via drill 0.4)
  Top 0.203: v48.4,43.5 49.4,42.5 R40.1 | v48.9,64 49.4,64.5 51.9,64.5 C18.- | v41.4,97.5 31.4,97.5 29.9,96 27.4,96 27.4,93.5 25.4,91.5 24.4,91.5 IC4.3
  Bottom 0.203: v48.4,43.5 48.9,44 v48.9,64 48.9,81.5 46.4,84 46.4,92.5 v41.4,97.5
FREQ_IN2  (via drill 0.4)
  Top 0.203: v37.9,35.5 29.9,35.5 27.9,37.5 R7.2 | v37.9,63 39.4,61.5 41.9,61.5 R41.1 | v37.9,70 33.4,70 30.9,72.5 IC1.12
  Bottom 0.203: v37.9,63 37.9,62.5 | 37.9,62.5 v37.9,35.5 | v37.9,70 39.4,68.5 39.4,64 37.9,62.5
GND  (via drill 0.4)
  Top 0.406: 45.4,88 IN2LEVEL.P$1 39.4,82.5 35.4,82.5 34.4,81.5 33.9,81.5 | C6.1 4.9,71 4.9,75.5 C4.1 4.9,76 4.9,77 6.9,79 C9.2 6.9,79.5 8.9,81.5 24.4,81.5 | 24.4,81.5 C5.2 | 26.9,81.5 24.4,81.5 | 26.9,81.5 27.9,80.5 C25.2 | 33.9,81.5 33.9,80 C17.2 | 26.9,81.5 33.9,81.5 | IN3LEVEL.P$1 17.4,88.5 23.9,88.5 IC4.5 | 27.9,101 25.9,99 C32.1 | 27.9,101 C1.2 C31.2 27.9,106.5 48.9,106.5 | C2.1 20.9,101 27.9,101 | IC3.1 64.4,83 64.4,88 IN1LEVEL.P$1 59.9,90 47.4,90 45.4,88 | 45.9,110 C11.2 | IN2.GND 45.9,110 | 48.9,108 48.9,110 45.9,110 | 48.9,108 48.9,106.5 | 48.9,106.5 48.9,105 R4.2 | IN1.GND 63.9,108 48.9,108 | 45.4,88 C26.1 | 25.9,33.5 26.9,32.5 27.9,32.5 C27.2 29.4,28.5 37.9,28.5 C29.2 | RES.P1 24.9,25 25.9,24 D6.1 | C30.1 3.4,38.5 4.4,37.5 5.4,37.5 C3.2 5.4,33.5 7.4,31.5 15.4,31.5 16.9,33 RESONANCE.P$3 16.9,33.5 25.9,33.5 | 25.9,33.5 C28.1 | POWER.7 27.4,19 29.4,19 POWER.5 29.9,19 31.9,19 POWER.3 32.4,18.5 32.4,13.5 POWER.4 31.9,13 | 52.9,17.5 54.4,17.5 C13.- | 52.9,17.5 49.4,17.5 46.9,15 C14.+ 46.9,14.5 42.9,10.5 34.4,10.5 31.9,13 | POWER.8 27.4,13 29.4,13 POWER.6 29.9,13 31.9,13 | FM_IN.P1 FM_IN.P2 | IC2.10 58.4,60 v58.4,63 58.4,65 IC2.5 | 46.9,58.5 50.4,55 INPUT_MIX.P1 | 46.9,58.5 44.4,61 R41.2 44.4,61.5 43.4,62.5 42.9,62.5 40.9,64.5 IC1.3 | v62.4,62 61.9,62 61.9,60 IC2.13 | v35.9,58 36.4,58.5 46.9,58.5 | FM-LEVEL.P$3 39.4,33 44.9,33 50.4,27.5 59.9,27.5 62.4,25 V-OCT.P2 V-OCT.P1 67.9,25 67.9,20 66.4,18.5 63.4,18.5 57.9,13 52.9,13 52.9,17.5
  Bottom 0.406: OUTPUTLEVEL.P$1 16.4,68.5 16.4,83.5 16.9,84 IN3LEVEL.P$1 20.9,92 IN3.GND 23.4,112.5 23.4,114.5 23.9,115 43.4,115 IN2.GND | IN1.GND 65.9,92 IN1LEVEL.P$1 61.4,87.5 61.4,70.5 63.4,68.5 63.4,67 60.4,64 | LED1.1 9.9,15.5 9.9,17 LED1.4 9.9,17.5 12.4,20 12.4,28.5 14.4,30.5 | 16.4,32.5 16.9,33 RESONANCE.P$3 16.4,32.5 | 16.4,32.5 14.4,30.5 | 16.4,32.5 16.4,51.5 19.9,55 OUTPUT2.P1 | 14.4,30.5 19.9,25 RES.P1 20.4,25 21.9,23.5 21.9,21.5 22.9,20.5 38.9,20.5 38.9,24 39.9,25 | FREQUENCY.P$3 61.9,33 62.4,32.5 62.4,25 V-OCT.P2 | 39.9,32.5 39.4,33 FM-LEVEL.P$3 39.9,32.5 | 39.9,25 39.9,32.5 | 60.4,64 59.4,65 58.4,65 | 60.4,64 v62.4,62 | 58.4,65 50.4,65 50.4,55 INPUT_MIX.P1 49.9,55 49.9,42.5 39.9,32.5 | v35.9,58 35.9,55.5 35.4,55 OUTPUT1.P1 | 58.4,65 v58.4,63 | 39.9,25 FM_IN.P2
N$1
  pour Top: 1.9,127.5 69.4,127.5 69.4,1.25 0.65,1.25 0.65,126.25
N$2
  Top 0.203: 25.9,47 25.9,47.5 R8.2 25.9,47 | 25.9,47 25.9,41.5 R6.1 | 25.9,47 20.4,47 16.9,50.5 2.4,50.5 2.4,55 3.9,56.5 10.4,56.5 14.9,52 31.9,52 32.9,51 33.4,51 33.9,50.5 IC5.2
N$3  (via drill 0.4)
  Top 0.203: v57.9,37.5 31.9,37.5 30.4,39 26.4,39 26.4,37.5 R7.1 | v64.4,50.5 66.4,52.5 R3.2 | v64.4,59 63.9,59 63.4,59.5 IC2.14
  Bottom 0.203: v57.9,37.5 64.4,44 v64.4,50.5 64.9,51 64.9,58.5 v64.4,59
N$4  (via drill 0.4)
  Top 0.203: v35.9,36.5 43.4,36.5 R9.1 | v35.4,53 34.4,52 IC5.1 | v34.4,42.5 28.9,42.5 27.9,41.5 R6.2
  Bottom 0.203: v35.9,36.5 35.4,37 35.4,42.5 | v35.4,53 35.4,42.5 | 35.4,42.5 v34.4,42.5
N$5
  Top 0.203: R2.1 51.4,30 51.4,28.5 54.9,28.5 59.4,33 FREQUENCY.P$2
N$6
  Top 0.203: D1.A 2.4,28.5 2.4,24 1.9,24 1.4,23.5 1.4,19 24.4,19 POWER.9 24.9,18.5 24.9,13.5 POWER.10
N$7  (via drill 0.4)
  Top 0.203: v36.4,49 34.9,49 34.4,49.5 IC5.3
  Bottom 0.203: v36.4,49 36.9,48.5 FM-LEVEL.P$2
N$8  (via drill 0.4)
  Top 0.203: v30.4,46 29.4,46 27.9,47.5 R8.1
  Bottom 0.203: v30.4,46 30.4,37.5 34.4,33.5 FM-LEVEL.P$1 34.4,26.5 32.9,25 FM_IN.P3
N$9  (via drill 0.4)
  Top 0.203: v51.4,57 49.9,58.5 R71.1
  Bottom 0.203: v51.4,57 51.4,35.5 41.4,25.5 41.4,22 38.9,19.5 17.9,19.5 17.9,25 RES.P2
N$10
  pour Bottom: 1.9,127.5 69.4,127.5 69.4,0 0.65,0 0.65,126.25
N$11  (via drill 0.4)
  Top 0.203: 41.4,47 40.4,48 39.9,48 IC5.5 | 41.4,47 43.4,45 R57.1 | OUTPUTLEVEL.P$2 15.9,66.5 v31.4,66.5 | 41.4,47 v33.9,47
  Bottom 0.203: v31.4,66.5 31.9,66 31.9,57.5 33.9,55.5 v33.9,47
N$12  (via drill 0.4)
  Top 0.203: 52.9,35 52.9,30 R2.2 | 52.9,35 51.4,36.5 45.4,36.5 R9.2 | 51.9,47.5 52.4,48 v56.4,48 | v60.9,62 60.9,60 IC2.12 | 52.9,35 54.4,36.5 58.4,36.5 58.9,37 58.9,45 49.9,45 48.4,46.5 48.4,49 50.4,49 51.9,47.5 | 52.9,35 R59.2 | 51.9,47.5 R61.2
  Bottom 0.203: v56.4,48 56.9,48.5 TR1.3 57.4,54.5 57.4,58.5 v60.9,62
N$13  (via drill 0.4)
  Top 0.203: 58.4,52.5 58.4,55.5 67.9,55.5 68.9,56.5 R32.1 | 58.4,52.5 58.4,47.5 R29.2 | v53.4,61.5 56.9,61.5 56.9,60 IC2.9 | 58.4,52.5 v53.4,52.5
  Bottom 0.203: v53.4,52.5 v53.4,61.5
N$14
  Top 0.203: 38.9,50 32.9,50 31.9,51 3.9,51 3.9,53.5 R10.1 | 38.9,50 39.4,50.5 IC5.7 | 38.9,50 39.4,49.5 IC5.6
N$15  (via drill 0.4)
  Top 0.203: v55.4,50 50.9,50 49.9,51 R31.1 | v55.4,63 56.9,64.5 56.9,65 IC2.6 | v64.4,60.5 64.9,60.5 66.9,62.5 R28.2
  Bottom 0.203: v55.4,63 v55.4,50 55.4,47 56.9,47 57.9,48 57.9,54 v64.4,60.5
N$18  (via drill 0.4)
  Top 0.203: v27.9,78.5 30.4,78.5 31.9,80 C17.1
  Bottom 0.203: v27.9,78.5 27.9,73 IC1.11
N$20  (via drill 0.4)
  Top 0.203: v36.4,108 26.4,108 26.4,110 R5.1
  Bottom 0.203: v36.4,108 46.9,97.5 46.9,88 56.9,78 IN_GAIN.P$3
N$21  (via drill 0.4)
  Top 0.203: v38.9,28.5 41.9,28.5 43.4,30 R39.1 | v22.9,64 23.4,64.5 25.4,64.5 IC1.9
  Bottom 0.203: v38.9,28.5 34.9,28.5 34.9,25.5 30.9,21.5 22.9,21.5 v22.9,64
N$28  (via drill 0.4)
  Top 0.203: v47.4,44.5 51.4,44.5 51.4,42.5 R40.2
  Bottom 0.203: v47.4,44.5 41.9,50 41.9,69 44.4,71.5 44.4,74.5 42.4,76.5 42.4,85.5 41.9,86 28.9,86 28.9,65.5 28.4,65 IC1.8
N$29  (via drill 0.4)
  Top 0.203: v33.4,76 31.9,76 R42.2
  Bottom 0.203: v33.4,76 33.4,73 IC1.13
N$30  (via drill 0.4)
  Top 0.203: v38.4,85 36.9,85 34.9,83 8.4,83 4.9,79.5 C9.1
  Bottom 0.203: v38.4,85 41.9,85 41.9,74 40.9,73 IC1.16
N$31  (via drill 0.4)
  Top 0.203: v50.4,83 51.4,83 51.9,83.5 R14.1 | 50.9,69 51.9,68 C18.+ | 50.9,69 v50.4,69.5 | 50.9,69 29.4,69 25.9,72.5 IC1.10
  Bottom 0.203: v50.4,69.5 v50.4,83
N$32  (via drill 0.4)
  Top 0.203: v23.4,74.5 C19.2 | v21.9,62 22.4,62.5 33.4,62.5 35.4,64.5 IC1.5
  Bottom 0.203: v23.4,74.5 22.9,74 22.9,65.5 21.9,64.5 v21.9,62
N$33
  Top 0.203: 19.4,61.5 20.9,60 R16.1 | 19.4,61.5 C16.2 | 19.4,61.5 20.9,63 28.9,63 30.4,64.5 IC1.7
N$34  (via drill 0.4)
  Top 0.203: C16.1 16.9,66 11.9,66 10.4,67.5 10.4,69.5 27.9,69.5 29.9,67.5 v37.9,67.5
  Bottom 0.203: v37.9,67.5 37.9,65 IC1.4
N$35  (via drill 0.4)
  Top 0.203: v42.9,59.5 38.9,59.5 36.9,61.5 R38.1
  Bottom 0.203: v42.9,59.5 42.9,64.5 IC1.2
N$36
  Top 0.203: 36.9,66.5 36.9,64 34.9,62 R38.2 | 36.9,66.5 34.9,66.5 33.4,65 IC1.6 | 36.9,66.5 46.9,66.5 46.9,64.5 48.4,63 53.4,63 53.4,70.5 47.9,76 R37.2
N$37  (via drill 0.4)
  Top 0.203: v42.9,57 25.9,57 22.9,60 R16.2
  Bottom 0.203: v42.9,57 45.4,59.5 45.4,64.5 IC1.1
N$38
  Top 0.203: 42.9,73.5 43.4,73 IC1.17 42.9,73.5 | 42.9,73.5 38.9,77.5 36.9,77.5 36.4,77 36.4,76.5 R30.1 | 42.9,73.5 43.4,73.5 45.9,76 R37.1 45.9,76.5 46.9,77.5 47.4,77.5 47.4,80 R36.2
N$41  (via drill 0.4)
  Top 0.203: 38.9,81 38.9,81.5 44.4,81.5 45.9,80 R36.1 | 38.9,81 38.9,80 R15.1 | v35.9,78 35.9,81 38.9,81
  Bottom 0.203: v35.9,78 35.9,75 37.9,73 IC1.15
N$42  (via drill 0.4)
  Top 0.203: 46.4,82 46.4,83.5 R33.1 | 46.4,82 52.4,82 53.9,83.5 R14.2 | v44.4,76 40.4,80 R15.2 | v45.9,81.5 46.4,82
  Bottom 0.203: IC1.18 45.4,73 45.4,75 v44.4,76 44.4,80 v45.9,81.5
N$63  (via drill 0.4)
  Top 0.203: IC4.1 24.4,94 24.4,92.5 IC4.2 23.9,92.5 23.4,92 v22.4,92
  Bottom 0.203: v22.4,92 22.4,71.5 17.4,66.5 11.9,66.5 OUTPUTLEVEL.P$3
N$67  (via drill 0.4)
  Top 0.203: v51.4,31.5 51.4,35 R59.1
  Bottom 0.203: v51.4,31.5 54.9,28 54.9,25 V-OCT.P3
N$68
  Top 0.203: R3.1 68.9,52.5 68.9,54 TR1.1 TR1.2
N$74  (via drill 0.4)
  Top 0.203: v68.9,97 47.4,97 47.4,105 R4.1
  Bottom 0.203: v68.9,97 69.4,96.5 69.4,60 66.9,57.5 66.9,23 61.9,18 61.9,17.5 LED2.3 61.9,17 61.9,15.5 LED2.2
N$75  (via drill 0.4)
  Top 0.203: v5.4,40.5 5.4,49 R1.1
  Bottom 0.203: v5.4,40.5 4.4,39.5 4.4,17.5 LED1.3 4.4,17 4.4,15.5 LED1.2
N$76
  Bottom 0.203: IN1.TIP 56.9,107.5 IN1LEVEL.P$3
N$77
  Bottom 0.203: IN2.TIP 34.4,107.5 IN2LEVEL.P$3
N$78  (via drill 0.4)
  Top 0.203: v12.9,44 21.9,44 D3.A
  Bottom 0.203: v12.9,44 12.4,43.5 12.4,36.5 10.4,34.5 10.4,25 RES.P3
N$79  (via drill 0.4)
  Top 0.203: v45.4,115 R55.2
  Bottom 0.203: v45.4,115 57.9,115 57.9,89.5 IN1LEVEL.P$2
N$80  (via drill 0.4)
  Top 0.203: v24.4,114 6.4,114 5.4,115 R56.2
  Bottom 0.203: v24.4,114 35.4,114 35.4,89.5 IN2LEVEL.P$2
N$82
  Bottom 0.203: IN3.TIP 11.9,107.5 IN3LEVEL.P$3
N$83
  Top 0.203: IN3LEVEL.P$2 9.4,93 5.9,93 5.9,101 R62.2
N$84
  Top 0.203: 26.4,113 26.4,111.5 27.9,110 R5.2 | 26.4,113 26.4,115 R55.1 | 3.4,113 3.4,115 R56.1 | 3.4,113 3.4,101.5 R62.1 3.9,101 3.9,94 11.4,86.5 17.4,86.5 17.9,87 23.4,87 23.9,87.5 IC4.6 | 3.4,113 26.4,113
N$85  (via drill 0.4)
  Top 0.203: v26.9,45 37.4,45 37.4,44 R72.2 | v23.9,48 23.4,48.5 21.9,48.5 D3.C
  Bottom 0.203: v23.9,48 v26.9,45
N$89  (via drill 0.4)
  Top 0.203: v28.4,26.5 26.9,26.5 D6.3 | v28.4,43.5 35.9,43.5 R72.1 | v25.9,85 26.4,85 26.4,86.5 28.4,88.5 29.4,88.5 IC4.10
  Bottom 0.203: v28.4,26.5 v28.4,43.5 28.4,45 26.4,47 26.4,55.5 24.4,57.5 24.4,83.5 v25.9,85
N$102
  Top 0.203: R79.2 28.9,83.5 31.4,86 31.4,92.5 29.9,92.5 | 29.9,92.5 29.9,94 IC4.14 | 29.9,92.5 IC4.13
N$103  (via drill 0.4)
  Top 0.203: v4.9,81 4.9,83.5 R79.1 | v7.9,47.5 13.4,42 22.9,42 24.9,40 29.4,40 31.4,42 33.4,42 33.9,41.5 v38.9,41.5
  Bottom 0.203: v4.9,81 7.9,78 v7.9,47.5 | v38.9,41.5 39.9,42.5 39.9,55 INPUT_MIX.P3
O1
  Top 0.203: OUTPUT2.P3 6.4,55 5.4,54 R10.2
O2  (via drill 0.4)
  Top 0.203: v32.9,46 37.9,46 40.4,43.5 44.9,43.5 44.9,45 R57.2 | v28.4,53 26.4,55 OUTPUT1.P3
  Bottom 0.203: v32.9,46 28.4,50.5 v28.4,53
RESONANCE_CTL2
  Top 0.203: R39.2 44.9,30 44.9,32 31.9,32 28.9,35 15.9,35 14.4,33.5 RESONANCE.P$2
RESONANCE_IN2  (via drill 0.4)
  Top 0.203: IC4.9 29.9,87.5 29.9,86 IC4.8 29.4,86 27.4,84 16.4,84 v15.9,84.5
  Bottom 0.203: v15.9,84.5 11.9,80.5 11.9,70 10.4,68.5 10.4,56.5 13.9,53 13.9,35.5 11.9,33.5 RESONANCE.P$1

### Text on the board
Bottom: The Queen in Red | Inputs
tNames: -12V
bNames: Based on work by / Forestcaver | V1.0 / (CC BY 4.0) | Band pass filter / Design Andy C
bStop: The Queen in Red | Inputs